# EAGLE design BusinessCard (EAGLE 7.4.0)
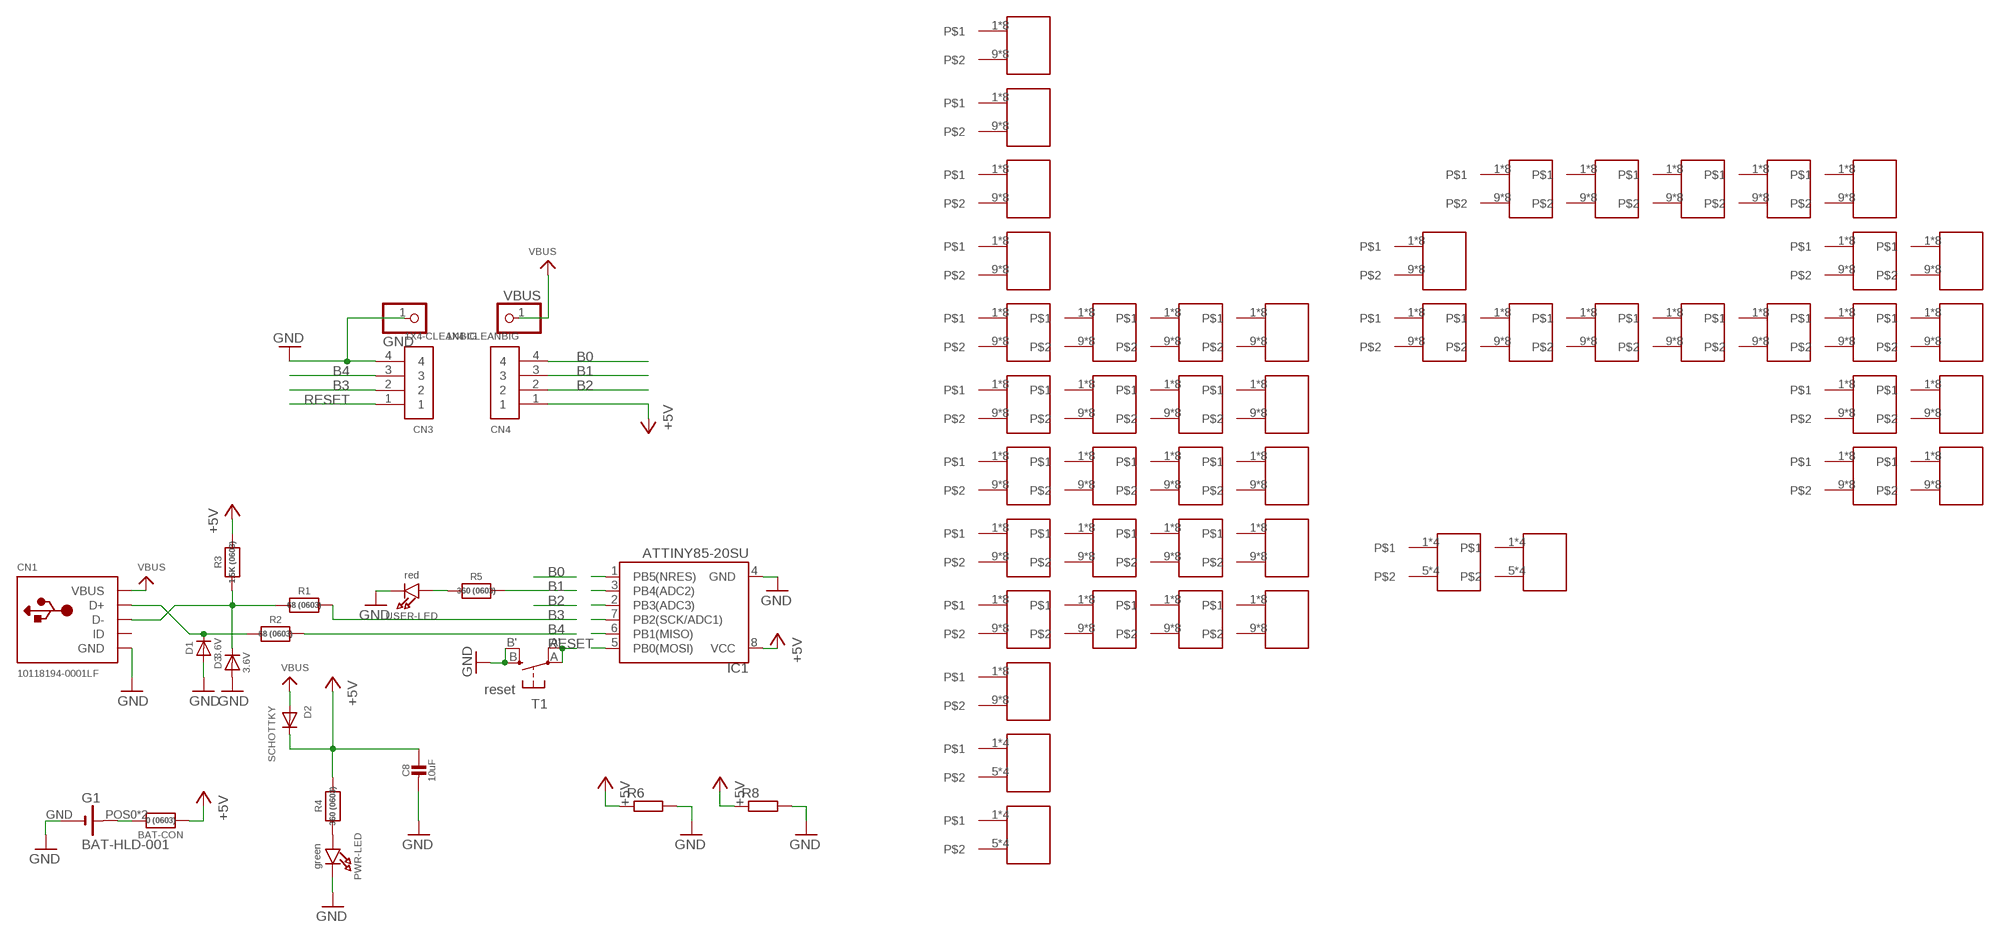
[diagram p0: schematic, sheet 1]

## Parts
BAT-CON  0 (0603)  RESISTOR_0603_NOOUT  [0603-NO]
C8  10uF  CAP_CERAMIC0805-NOOUTLINE  [0805-NO]
CN1  10118194-0001LF  USBMICRO_20329  [4UCONN_20329]
CN3  1X4-CLEANBIG  [1X04-CLEANBIG]
CN4  1X4-CLEANBIG  [1X04-CLEANBIG]
D1  3.6V  DIODESOD-323  [SOD-323]
D2  SCHOTTKY  DIODE_SOD-123FL  [SOD-123FL]
D3  3.6V  DIODESOD-323  [SOD-323]
G1  BAT-HLD-001  BK-889  [BK-889]
GND  PINHD-1X1CB  [1X01-CLEANBIG]
IC1  ATTINY85-20SU  ATTINY45TINY85-20-SMT  [SO08-EIAJ]
PWR-LED  green  LED0805_NOOUTLINE  [CHIPLED_0805_NOOUTLINE]
R1  68 (0603)  RESISTOR_0603_NOOUT  [0603-NO]
R2  68 (0603)  RESISTOR_0603_NOOUT  [0603-NO]
R3  1.5K (0603)  RESISTOR_0603_NOOUT  [0603-NO]
R4  360 (0603)  RESISTOR_0603_NOOUT  [0603-NO]
R5  360 (0603)  RESISTOR_0603_NOOUT  [0603-NO]
R6  R-EU_M0805  [M0805]
R8  R-EU_M0805  [M0805]
T1  reset  EVQQ2  [EVQ-Q2]
U$5  SMD0805  [SMD-0603]
U$6  SMD0805  [SMD-0603]
U$7  SMD0805  [SMD-0603]
U$8  SMD0805  [SMD-0603]
U$9  SMD0805  [SMD-0603]
U$13  SMD0805  [SMD-0603]
U$15  SMD0805  [SMD-0603]
U$17  SMD0805  [SMD-0603]
U$18  SMD0805  [SMD-0603]
U$19  SMD0805  [SMD-0603]
U$20  SMD0805  [SMD-0603]
U$21  SMD0805  [SMD-0603]
U$22  SMD0805  [SMD-0603]
U$23  SMD0805  [SMD-0603]
U$24  SMD0805  [SMD-0603]
U$25  SMD0805  [SMD-0603]
U$26  SMD0805  [SMD-0603]
U$27  SMD0805  [SMD-0603]
U$28  SMD0805  [SMD-0603]
U$29  SMD0805  [SMD-0603]
U$30  SMD0805  [SMD-0603]
U$31  SMD0805  [SMD-0603]
U$32  SMD0805  [SMD-0603]
U$33  SMD0805  [SMD-0603]
U$34  SMD0805  [SMD-0603]
U$35  SMD0805  [SMD-0603]
U$36  SMD0805  [SMD-0603]
U$37  SMD0805  [SMD-0603]
U$38  SMD-4  [SMD-4]
U$39  SMD-4  [SMD-4]
U$40  SMD0805  [SMD-0603]
U$43  SMD0805  [SMD-0603]
U$45  SMD0805  [SMD-0603]
U$48  SMD0805  [SMD-0603]
U$50  SMD0805  [SMD-0603]
U$53  SMD0805  [SMD-0603]
U$55  SMD0805  [SMD-0603]
U$56  SMD0805  [SMD-0603]
U$57  SMD0805  [SMD-0603]
U$58  SMD0805  [SMD-0603]
U$59  SMD0805  [SMD-0603]
U$60  SMD0805  [SMD-0603]
U$61  SMD0805  [SMD-0603]
U$62  SMD0805  [SMD-0603]
U$63  SMD0805  [SMD-0603]
U$64  SMD0805  [SMD-0603]
U$65  SMD-4  [SMD-4]
U$66  SMD-4  [SMD-4]
USER-LED  red  LED0805_NOOUTLINE  [CHIPLED_0805_NOOUTLINE]
VBUS  PINHD-1X1CB  [1X01-CLEANBIG]

## Nets
+5V: BAT-CON.1 C8.1 CN4.1 D2.C IC1.8(VCC) R3.2 R4.2 R6.1 R8.1
B0: CN4.4 IC1.5(PB0(MOSI))
B1: CN4.3 IC1.6(PB1(MISO)) R5.2
B2: CN4.2 IC1.7(PB2(SCK/ADC1))
B3: CN3.2 IC1.2(PB3(ADC3)) R1.2
B4: CN3.3 IC1.3(PB4(ADC2)) R2.2
GND: C8.2 CN1.BASE@1(GND) CN1.BASE@2(GND) CN1.GND CN1.SPRT@1(GND) CN1.SPRT@2(GND) CN1.SPRT@3(GND) CN1.SPRT@4(GND) CN3.4 D1.A D3.A G1.GND(-) GND.1 IC1.4(GND) PWR-LED.C R6.2 R8.2 T1.B'(S1) T1.B(S) USER-LED.C
N$1: R5.1 USER-LED.A
N$2: CN1.D+ D1.C R2.1
N$3: BAT-CON.2 G1.POS0(+) G1.POS1(+)
N$5: CN1.D- D3.C R1.1 R3.1
N$6: PWR-LED.A R4.1
RESET: CN3.1 IC1.1(PB5(NRES)) T1.A'(P1) T1.A(P)
VBUS: CN1.VBUS D2.A VBUS.1
Unconnected: CN1.ID U$5.1 U$5.2 U$5.3 U$5.4 U$5.5 U$5.6 U$5.7 U$5.8 U$5.9 U$5.10 U$5.11 U$5.12 U$5.13 U$5.14 U$5.15 U$5.16 U$6.1 U$6.2 U$6.3 U$6.4 U$6.5 U$6.6 U$6.7 U$6.8 U$6.9 U$6.10 U$6.11 U$6.12 U$6.13 U$6.14 U$6.15 U$6.16 U$7.1 U$7.2 U$7.3 U$7.4 U$7.5 U$7.6 U$7.7 U$7.8 U$7.9 U$7.10 U$7.11 U$7.12 U$7.13 U$7.14 U$7.15 U$7.16 U$8.1 U$8.2 U$8.3 U$8.4 U$8.5 U$8.6 U$8.7 U$8.8 U$8.9 U$8.10 U$8.11 U$8.12 U$8.13 U$8.14 U$8.15 U$8.16 U$9.1 U$9.2 U$9.3 U$9.4 U$9.5 U$9.6 U$9.7 U$9.8 U$9.9 U$9.10 U$9.11 U$9.12 U$9.13 U$9.14 U$9.15 U$9.16 U$13.1 U$13.2 U$13.3 U$13.4 U$13.5 U$13.6 U$13.7 U$13.8 U$13.9 U$13.10 U$13.11 U$13.12 U$13.13 U$13.14 U$13.15 U$13.16 U$15.1 U$15.2 U$15.3 U$15.4 U$15.5 U$15.6 U$15.7 U$15.8 U$15.9 U$15.10 U$15.11 U$15.12 U$15.13 U$15.14 U$15.15 U$15.16 U$17.1 U$17.2 U$17.3 U$17.4 U$17.5 U$17.6 U$17.7 U$17.8 U$17.9 U$17.10 U$17.11 U$17.12 U$17.13 U$17.14 U$17.15 U$17.16 U$18.1 U$18.2 U$18.3 U$18.4 U$18.5 U$18.6 U$18.7 U$18.8 U$18.9 U$18.10 U$18.11 U$18.12 U$18.13 U$18.14 U$18.15 U$18.16 U$19.1 U$19.2 U$19.3 U$19.4 U$19.5 U$19.6 U$19.7 U$19.8 U$19.9 U$19.10 U$19.11 U$19.12 U$19.13 U$19.14 U$19.15 U$19.16 U$20.1 U$20.2 U$20.3 U$20.4 U$20.5 U$20.6 U$20.7 U$20.8 U$20.9 U$20.10 U$20.11 U$20.12 U$20.13 U$20.14 U$20.15 U$20.16 U$21.1 U$21.2 U$21.3 U$21.4 U$21.5 U$21.6 U$21.7 U$21.8 U$21.9 U$21.10 U$21.11 U$21.12 U$21.13 U$21.14 U$21.15 U$21.16 U$22.1 U$22.2 U$22.3 U$22.4 U$22.5 U$22.6 U$22.7 U$22.8 U$22.9 U$22.10 U$22.11 U$22.12 U$22.13 U$22.14 U$22.15 U$22.16 U$23.1 U$23.2 U$23.3 U$23.4 U$23.5 U$23.6 U$23.7 U$23.8 U$23.9 U$23.10 U$23.11 U$23.12 U$23.13 U$23.14 U$23.15 U$23.16 U$24.1 U$24.2 U$24.3 U$24.4 U$24.5 U$24.6 U$24.7 U$24.8 U$24.9 U$24.10 U$24.11 U$24.12 U$24.13 U$24.14 U$24.15 U$24.16 U$25.1 U$25.2 U$25.3 U$25.4 U$25.5 U$25.6 U$25.7 U$25.8 U$25.9 U$25.10 U$25.11 U$25.12 U$25.13 U$25.14 U$25.15 U$25.16 U$26.1 U$26.2 U$26.3 U$26.4 U$26.5 U$26.6 U$26.7 U$26.8 U$26.9 U$26.10 U$26.11 U$26.12 U$26.13 U$26.14 U$26.15 U$26.16 U$27.1 U$27.2 U$27.3 U$27.4 U$27.5 U$27.6 U$27.7 U$27.8 U$27.9 U$27.10 U$27.11 U$27.12 U$27.13 U$27.14 U$27.15 U$27.16 U$28.1 U$28.2 U$28.3 U$28.4 U$28.5 U$28.6 U$28.7 U$28.8 U$28.9 U$28.10 U$28.11 U$28.12 U$28.13 U$28.14 U$28.15 U$28.16 U$29.1 U$29.2 U$29.3 U$29.4 U$29.5 U$29.6 U$29.7 U$29.8 U$29.9 U$29.10 U$29.11 U$29.12 U$29.13 U$29.14 U$29.15 U$29.16 U$30.1 U$30.2 U$30.3 U$30.4 U$30.5 U$30.6 U$30.7 U$30.8 U$30.9 U$30.10 U$30.11 U$30.12 U$30.13 U$30.14 U$30.15 U$30.16 U$31.1 U$31.2 U$31.3 U$31.4 U$31.5 U$31.6 U$31.7 U$31.8 U$31.9 U$31.10 U$31.11 U$31.12 U$31.13 U$31.14 U$31.15 U$31.16 U$32.1 U$32.2 U$32.3 U$32.4 U$32.5 U$32.6 U$32.7 U$32.8 U$32.9 U$32.10 U$32.11 U$32.12 U$32.13 U$32.14 U$32.15 U$32.16 U$33.1 U$33.2 U$33.3 U$33.4 U$33.5 U$33.6 U$33.7 U$33.8 U$33.9 U$33.10 U$33.11 U$33.12 U$33.13 U$33.14 U$33.15 U$33.16 U$34.1 U$34.2 U$34.3 U$34.4 U$34.5 U$34.6 U$34.7 U$34.8 U$34.9 U$34.10 U$34.11 U$34.12 U$34.13 U$34.14 U$34.15 U$34.16 U$35.1 U$35.2 U$35.3 U$35.4 U$35.5 U$35.6 U$35.7 U$35.8 U$35.9 U$35.10 U$35.11 U$35.12 U$35.13 U$35.14 U$35.15 U$35.16 U$36.1 U$36.2 U$36.3 U$36.4 U$36.5 U$36.6 U$36.7 U$36.8 U$36.9 U$36.10 U$36.11 U$36.12 U$36.13 U$36.14 U$36.15 U$36.16 U$37.1 U$37.2 U$37.3 U$37.4 U$37.5 U$37.6 U$37.7 U$37.8 U$37.9 U$37.10 U$37.11 U$37.12 U$37.13 U$37.14 U$37.15 U$37.16 U$38.1 U$38.2 U$38.3 U$38.4 U$38.5 U$38.6 U$38.7 U$38.8 U$39.1 U$39.2 U$39.3 U$39.4 U$39.5 U$39.6 U$39.7 U$39.8 U$40.1 U$40.2 U$40.3 U$40.4 U$40.5 U$40.6 U$40.7 U$40.8 U$40.9 U$40.10 U$40.11 U$40.12 U$40.13 U$40.14 U$40.15 U$40.16 U$43.1 U$43.2 U$43.3 U$43.4 U$43.5 U$43.6 U$43.7 U$43.8 U$43.9 U$43.10 U$43.11 U$43.12 U$43.13 U$43.14 U$43.15 U$43.16 U$45.1 U$45.2 U$45.3 U$45.4 U$45.5 U$45.6 U$45.7 U$45.8 U$45.9 U$45.10 U$45.11 U$45.12 U$45.13 U$45.14 U$45.15 U$45.16 U$48.1 U$48.2 U$48.3 U$48.4 U$48.5 U$48.6 U$48.7 U$48.8 U$48.9 U$48.10 U$48.11 U$48.12 U$48.13 U$48.14 U$48.15 U$48.16 U$50.1 U$50.2 U$50.3 U$50.4 U$50.5 U$50.6 U$50.7 U$50.8 U$50.9 U$50.10 U$50.11 U$50.12 U$50.13 U$50.14 U$50.15 U$50.16 U$53.1 U$53.2 U$53.3 U$53.4 U$53.5 U$53.6 U$53.7 U$53.8 U$53.9 U$53.10 U$53.11 U$53.12 U$53.13 U$53.14 U$53.15 U$53.16 U$55.1 U$55.2 U$55.3 U$55.4 U$55.5 U$55.6 U$55.7 U$55.8 U$55.9 U$55.10 U$55.11 U$55.12 U$55.13 U$55.14 U$55.15 U$55.16 U$56.1 U$56.2 U$56.3 U$56.4 U$56.5 U$56.6 U$56.7 U$56.8 U$56.9 U$56.10 U$56.11 U$56.12 U$56.13 U$56.14 U$56.15 U$56.16 U$57.1 U$57.2 U$57.3 U$57.4 U$57.5 U$57.6 U$57.7 U$57.8 U$57.9 U$57.10 U$57.11 U$57.12 U$57.13 U$57.14 U$57.15 U$57.16 U$58.1 U$58.2 U$58.3 U$58.4 U$58.5 U$58.6 U$58.7 U$58.8 U$58.9 U$58.10 U$58.11 U$58.12 U$58.13 U$58.14 U$58.15 U$58.16 U$59.1 U$59.2 U$59.3 U$59.4 U$59.5 U$59.6 U$59.7 U$59.8 U$59.9 U$59.10 U$59.11 U$59.12 U$59.13 U$59.14 U$59.15 U$59.16 U$60.1 U$60.2 U$60.3 U$60.4 U$60.5 U$60.6 U$60.7 U$60.8 U$60.9 U$60.10 U$60.11 U$60.12 U$60.13 U$60.14 U$60.15 U$60.16 U$61.1 U$61.2 U$61.3 U$61.4 U$61.5 U$61.6 U$61.7 U$61.8 U$61.9 U$61.10 U$61.11 U$61.12 U$61.13 U$61.14 U$61.15 U$61.16 U$62.1 U$62.2 U$62.3 U$62.4 U$62.5 U$62.6 U$62.7 U$62.8 U$62.9 U$62.10 U$62.11 U$62.12 U$62.13 U$62.14 U$62.15 U$62.16 U$63.1 U$63.2 U$63.3 U$63.4 U$63.5 U$63.6 U$63.7 U$63.8 U$63.9 U$63.10 U$63.11 U$63.12 U$63.13 U$63.14 U$63.15 U$63.16 U$64.1 U$64.2 U$64.3 U$64.4 U$64.5 U$64.6 U$64.7 U$64.8 U$64.9 U$64.10 U$64.11 U$64.12 U$64.13 U$64.14 U$64.15 U$64.16 U$65.1 U$65.2 U$65.3 U$65.4 U$65.5 U$65.6 U$65.7 U$65.8 U$66.1 U$66.2 U$66.3 U$66.4 U$66.5 U$66.6 U$66.7 U$66.8

## Library data of the parts
BAT-CON R1-R5 = microbuilder:RESISTOR: Resistors For new designs, use the packages preceded by an '_' character since they are more reliable: The following footprints should be used on most boards: _0402 - Standard footprint for regular board layouts _0603 - Standard footprint for regular board layouts _0805 - Standard footprint for regular board layouts _1206 - Standard footprint for regular board layouts For extremely tight-pitch boards where space is at a premium, the following 'micro-pitch' footprints can be used (smaller pads, no silkscreen outline, etc.): _0402MP - Micro-pitch footprint for very dense/compact boards _0603MP - Micro-pitch footprint for very dense/compact boards _0805MP - Micro-pitch footprint for very dense/compact boards _1206MP - Micro-pitch footprint for very dense/compact boards
C8 = microbuilder:CAP_CERAMIC: Ceramic Capacitors For new designs, use the packages preceded by an '_' character since they are more reliable: The following footprints should be used on most boards: _0402 - Standard footprint for regular board layouts _0603 - Standard footprint for regular board layouts _0805 - Standard footprint for regular board layouts _1206 - Standard footprint for regular board layouts For extremely tight-pitch boards where space is at a premium, the following 'micro-pitch' footprints can be used (smaller pads, no silkscreen outline, etc.): _0402MP - Micro-pitch footprint for very dense/compact boards _0603MP - Micro-pitch footprint for very dense/compact boards _0805MP - Micro-pitch footprint for very dense/compact boards _1206MP - Micro-pitch footprint for very dense/compact boards
CN1 = microbuilder:USB: USB Connectors USBMINIB - Surface Mount Female Mini-B USB Connector 4UConnector: 06564
CN3 CN4 = adafruit:1X4: 4-pin connector
D1 D3 = microbuilder:DIODE: Diode
D2 = adafruit:DIODE: Diode
G1 = battery:BK-889: CION CELL RETAINER FOR 23mm DIA. BATTERIES BR2320, CL2320, CR2320, BR2325, CR2325, DL2325, BR2330, CL2330 Source: MEMORY PROTECTION DEVICES; Inc. BK-889-datasheet.pdf
GND VBUS = adafruit:PINHD-1X1: Pin header 1x1 for 0.1" spacing With round pins
IC1 = SparkFun-DigitalIC:ATTINY45: Atmel 8-pin 2/4/8kB flash uC; PROD_ID: IC-09092; VALUE: Tiny85-20-SMT
PWR-LED USER-LED = microbuilder:LED: LED 0603 - 0603 Surface Mount Package 2mA: Green LED - Low Power (3.9mcd, 2ma, 1.7Vf) - Digikey: 475-2709-2-ND Orange LED - Low Power (9.8mcd, 2ma, 1.8Vf) - Digikey: 475-1194-2-ND Red LED - Low Power (5mcd, 2ma, 1.8Vf) - Digikey: 475-1195-2-ND Yellow LED - Low Power (7mcd, 2ma, 1.8Vf) - Digikey: 475-1196-2-ND 5mA: Blue LED - Low Power (17mcd, 5ma, 2.9Vf) - Digikey: LNJ937W8CRACT-ND 0805 - 0805 Surface Mount Package 2mA: Red LED (8.8mcd, 2mA, 1.8Vf, Clear) - Low Power [Digikey: 475-2510-1-ND] Green LED (5mcd, 2mA, 1.8Vf, Clear) - Low Power [Digikey: 475-2730-1-ND] Yellow LED (11.3mcd, 2mA, 1.8Vf, Clear) - Low Power [Digikey: 475-2555-1-ND] 20mA: Red LED (104mcd, 20mA, Diffused) - LS R976 [Digikey: 475-1278-6-ND] Red LED (12mcd, 20mA, 2.0Vf, Clear) - APT2012EC [Digikey: 754-1128-1-ND] Green LED (15mcd, 20mA, 2.2Vf, Clear) - APT2012GC [Digikey: 754-1131-1-ND] Orange LED (160mcd, 20mA, 2.1Vf, Clear) - APT2012SECK [Digikey: 754-1130-1-ND] 1206 - 1206 Surface Mount Package Green LED (26mcd, 20mA, Diffused) - LG N971 [Digikey: 475-1407-6-ND] Red LED (15mcd, 20mA, Diffused) - LH N974 [Digikey: 475-1416-6-ND] Cree - Cree High-Power Surface Mount LEDs XPEBWT-L1-0000-00D50 - White 111lm 350mA 2.9Vf 6200K 110° XTEAWT-00-0000-00000LEE3 - White 114lm 350mA 2.85Vf 5000K 115° Everlight - Everlight 45-21 Series Surface Mount LEDs 45-21/QK2C-B2832AC2CB2/2T - Warm White 2000mcd 20mA 3.25Vf 3050K 120° 45-21/LK2C-B38452C4CB2/2T - Nuetral White 2000mcd 20mA 3.25Vf 4150K 120° 45-21/LK2C-B50634C6CB2/2T - Cold White 2200mcd 20mA 3.25Vf 5650K 120° PLCC2 Reverse Mount LS T77K-J1L2-1-0-2-R18-Z - Red 11.25mcd 2mA 1.8Vf 630nm 120° LO T77K-L1M2-24-Z - Orange 19.6mcd 2mA 1.8Vf 606nm 120° LY T77K-K2M1-26-Z - Yellow 15.7mcd 2mA 1.8Vf 587nm 120°
R6 R8 = rcl:R-EU_: RESISTOR, European symbol
T1 = adafruit:EVQQ2: SMT 6mm switch, EVQQ2 series http://www.ladyada.net/library/eagle
U$5-U$9 U$13 U$15 U$17-U$37 U$40 U$43 U$45 U$48 U$50 U$53 U$55-U$64 = zwave:SMD0805
U$38 U$39 U$65 U$66 = zwave:SMD-4

## Board
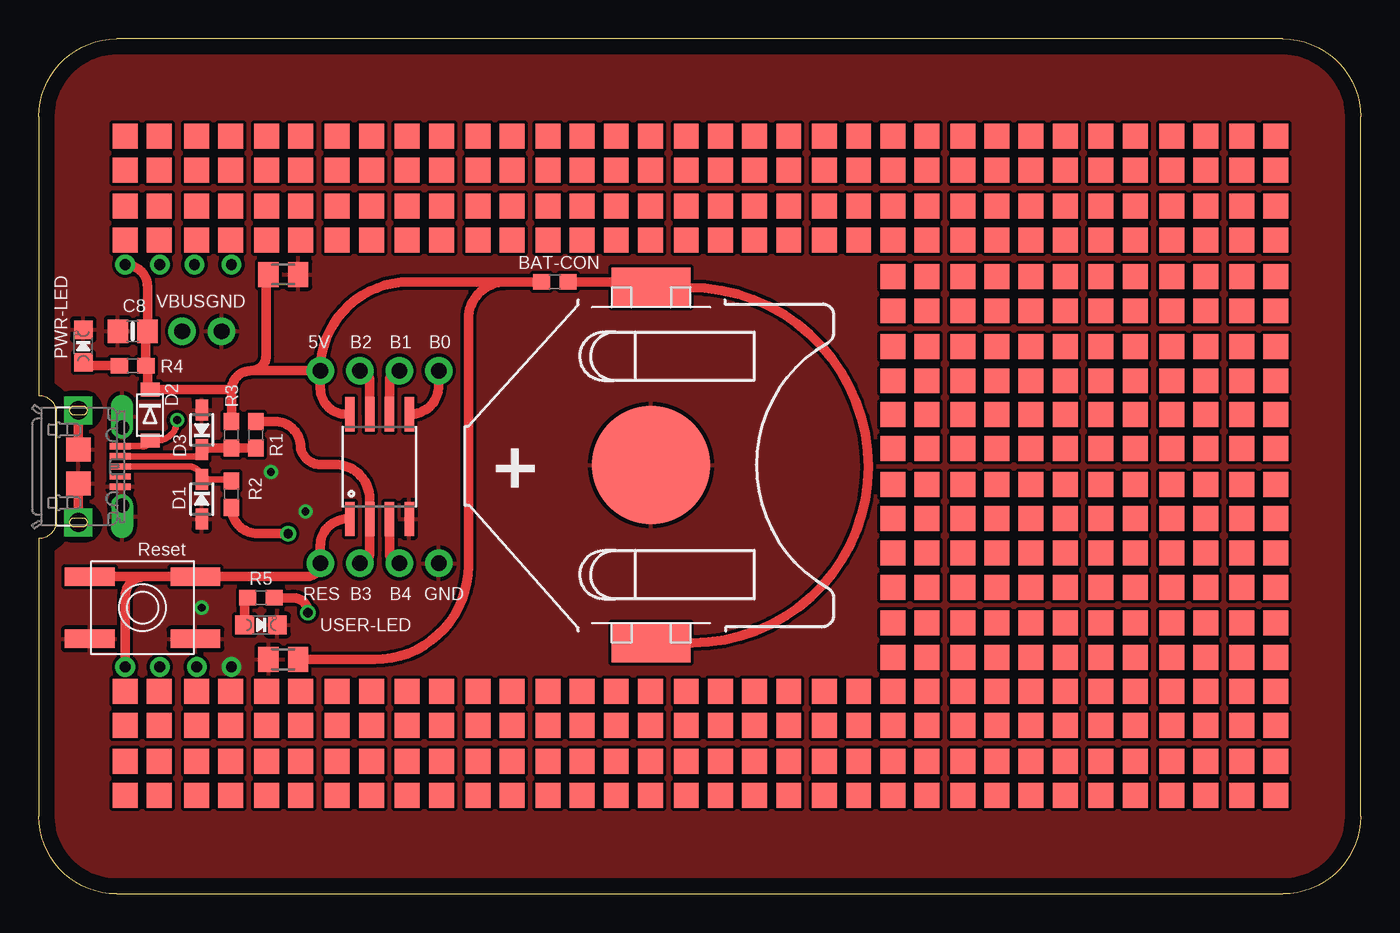
[diagram p1: board, top side]
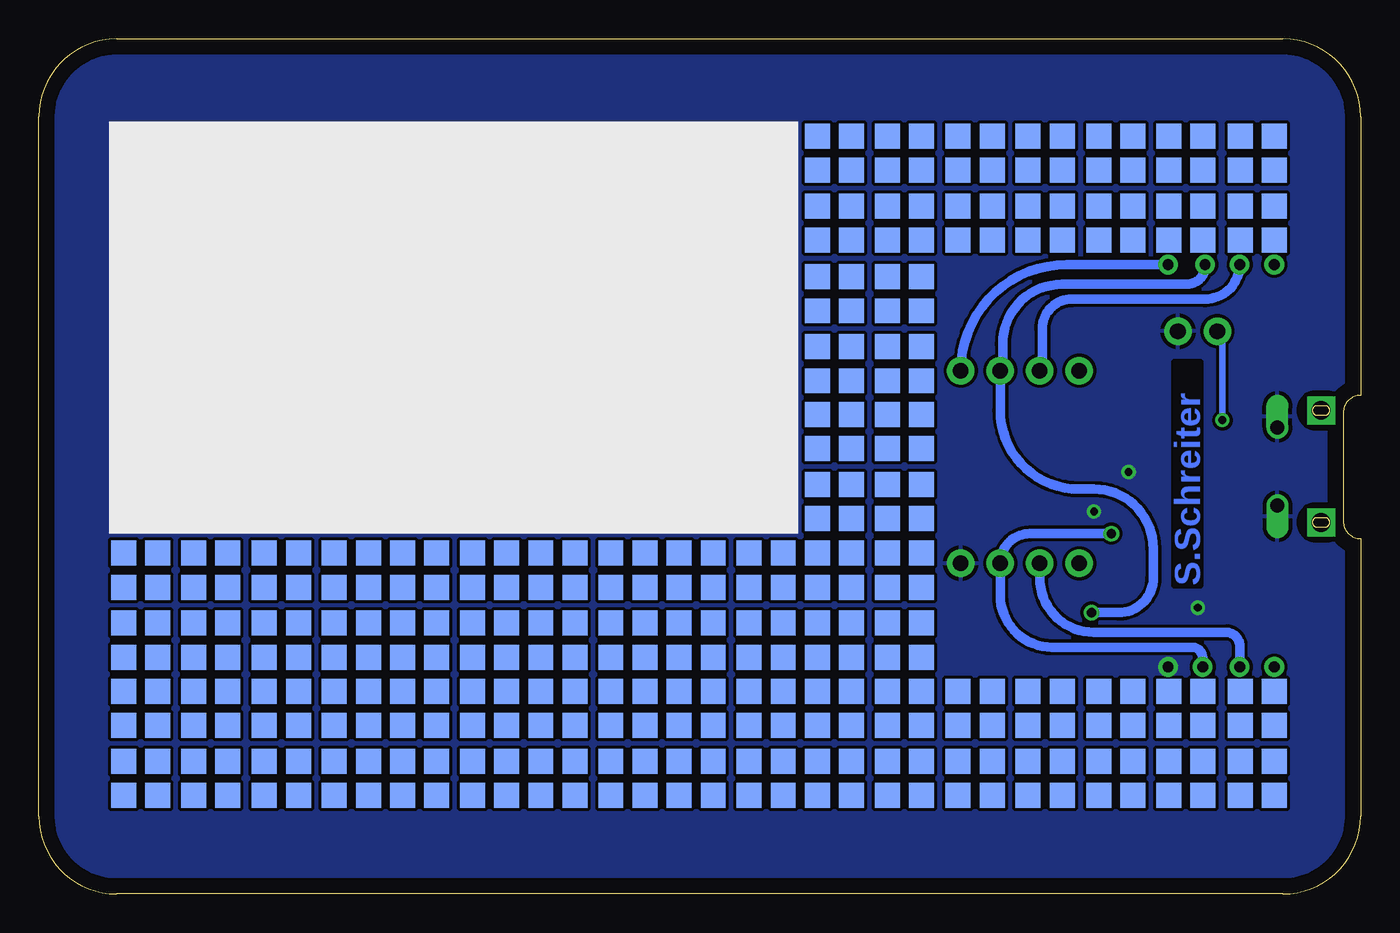
[diagram p2: board, bottom side, seen from below]

Size 85 x 55 mm. Coordinates in mm from the lower left corner, seen from the top.
Outline: 5,0 80,0 arc90 85,5 85,50 arc90 80,55 5,55 arc90 0,50 0,32.07 arc-90 1.11,30.96 1.11,23.97 arc-90 0,22.86 0,5 arc90 5,0
Copper layers (1*16): Top 0.035mm / dielectric 1.5mm / Bottom 0.035mm
Design rules "default": minimum track width 10mil, minimum drill 24mil, track to track 8mil, track to pad 8mil, pad to pad 8mil, via to via 8mil, smd to smd 8mil, copper to edge 40mil, drill to drill 8mil, minimum pad ring 10mil, minimum via ring 8mil, stop-mask expansion 4mil, vias tented up to drill 0mil, thermal gap 10mil

### Footprints (pad centres in the part's own frame; a part is rotated, then mirrored left to right if it is on the bottom)
0603-NO = smd 1.1 x 1: 1 -0.85,0; 2 0.85,0
0805-NO = smd 1.3 x 1.5: 1 -0.95,0; 2 0.95,0
4UCONN_20329 = smd 1.55 x 1.55: BASE@1 -1.1,-1.9; BASE@2 1.1,-1.9 | smd 0.4 x 1.35: D+ 0,0.775; D- -0.65,0.775; GND 1.3,0.775; ID 0.65,0.775; VBUS -1.3,0.775 | drill 0.9 offset: SPRT@1 -2.5,0.9; SPRT@2 2.5,0.9 | drill 1.2 pad 1.65 square: SPRT@3 -3.6,-1.9; SPRT@4 3.6,-1.9
1X04-CLEANBIG = drill 1.016 pad 1.778: 1 -3.81,0; 2 -1.27,0; 3 1.27,0; 4 3.81,0
SOD-323 = smd 1.35 x 0.8: A 1.27,0; C -1.27,0
SOD-123FL = smd 0.91 x 1.22: A 1.637,0; C -1.637,0
BK-889 = smd 7.62 x 7.62: GND 0,0 | smd 2.54 x 5.08: POS0 -11.43,0; POS1 11.43,0
1X01-CLEANBIG = drill 1.016 pad 1.778: 1 0,0
SO08-EIAJ = smd 0.61 x 2.21: 1 -1.905,-3.378; 2 -0.635,-3.378; 3 0.635,-3.378; 4 1.905,-3.378; 5 1.905,3.353; 6 0.635,3.353; 7 -0.635,3.353; 8 -1.905,3.353
CHIPLED_0805_NOOUTLINE = smd 1.2 x 1.2: A 0,-1.05; C 0,1.05
M0805 = smd 1.3 x 1.6: 1 -0.95,0; 2 0.95,0
EVQ-Q2 = smd 3.2 x 1.2: A -3.4,-2; A' 3.4,-2; B -3.4,2; B' 3.4,2
SMD-0603 = smd 1.6 x 1.6: 1 -1.15,3.35; 2 -3.35,1.15; 3 -1.15,1.15; 4 -3.35,3.35; 5 1.15,3.35; 6 3.35,3.35; 7 1.15,1.15; 8 3.35,1.15; 9 -3.35,-1.15; 10 -1.15,-1.15; 11 -3.35,-3.35; 12 -1.15,-3.35; 13 1.15,-1.15; 14 3.35,-1.15; 15 1.15,-3.35; 16 3.35,-3.35
SMD-4 = smd 1.6 x 1.6: 1 -1.15,1.127; 2 -3.35,-1.073; 3 -1.15,-1.073; 4 -3.35,1.127; 5 1.15,1.127; 6 3.35,1.127; 7 1.15,-1.073; 8 3.35,-1.073

### Placement (x,y rotation side)
BAT-CON  33.18,39.37 0 top
C8  6.03,36.2 180 top
CN1  4.45,27.5 270 top
CN3  21.91,21.27 0 top
CN4  21.91,33.66 0 top
D1  10.48,25.4 270 top
D2  7.14,30.8 270 top
D3  10.48,29.84 90 top
G1  39.37,27.59 270 top
GND  11.75,36.2 0 top
IC1  21.91,27.5 0 top
PWR-LED  2.86,35.24 0 top
R1  13.97,29.53 90 top
R2  12.38,25.72 270 top
R3  12.38,29.53 90 top
R4  6.03,33.97 0 top
R5  14.29,19.05 0 top
R6  15.72,39.85 0 top
R8  15.72,15.08 180 top
T1  6.67,18.41 180 top
U$5  31.59,45.4 0 top
U$6  76.2,18.57 0 bottom
U$7  31.59,9.68 0 top
U$8  40.48,45.4 0 top
U$9  76.2,9.68 0 bottom
U$13  40.48,9.68 0 top
U$15  67.15,18.57 0 bottom
U$17  58.26,36.35 0 top
U$18  49.37,9.68 0 top
U$19  49.37,45.4 0 top
U$20  58.26,45.4 0 top
U$21  58.26,18.57 0 top
U$22  58.26,27.5 0 top
U$23  58.26,9.68 0 top
U$24  67.15,27.5 0 top
U$25  67.15,36.35 0 top
U$26  67.15,45.4 0 top
U$27  76.2,27.5 0 top
U$28  76.2,36.35 0 top
U$29  67.15,18.57 0 top
U$30  76.2,45.4 0 top
U$31  76.2,18.57 0 top
U$32  67.15,9.68 0 top
U$33  76.2,9.68 0 top
U$34  22.54,9.68 0 top
U$35  13.49,9.68 0 top
U$36  22.54,45.4 0 top
U$37  13.49,45.4 0 top
U$38  6.67,45.4 90 top
U$39  6.67,9.68 90 top
U$40  67.15,9.68 0 bottom
U$43  58.26,18.57 0 bottom
U$45  58.26,9.68 0 bottom
U$48  49.37,18.57 0 bottom
U$50  49.37,9.68 0 bottom
U$53  40.48,18.57 0 bottom
U$55  40.48,9.68 0 bottom
U$56  31.59,9.68 0 bottom
U$57  31.59,27.5 0 bottom
U$58  22.54,9.68 0 bottom
U$59  31.59,45.4 0 bottom
U$60  22.54,45.4 0 bottom
U$61  13.49,45.4 0 bottom
U$62  13.49,9.68 0 bottom
U$63  31.59,36.35 0 bottom
U$64  31.59,18.57 0 bottom
U$65  6.67,45.4 270 bottom
U$66  6.67,9.68 270 bottom
USER-LED  14.29,17.3 270 top
VBUS  9.21,36.2 0 top

### Tracks (layer width: path | path; a pad name or v marks a point on that pad's centre or on a via)
+5V  (via drill 0.7 pad 1.27)
  Top 0.61: R3.2 12.38,32.38 | 12.38,32.38 arc-90 13.65,33.66 | 13.65,33.66 CN4.1 | 12.38,32.38 arc90 12.33,32.44 D2.C arc-90 6.99,32.59 6.99,33.87 arc90 R4.2 6.88,36.09 arc-90 C8.1 6.98,39.05 arc90 v5.56,40.48 | BAT-CON.1 30,39.37 | 30,39.37 23.81,39.37 arc90 CN4.1 | CN4.1 18.1,32.54 arc90 19.79,30.85 IC1.8 | 13.65,33.66 arc90 14.61,34.61 14.61,39.69 arc-90 R6.1 | R8.1 21.59,15.08 arc90 27.62,21.11 27.62,36.99 arc-90 30,39.37
B0  (via drill 0.7 pad 1.27)
  Top 0.61: IC1.5 23.87,30.85 arc90 25.72,32.7 CN4.4
  Bottom 0.61: v12.38,40.48 18.89,40.48 arc-90 CN4.4
B1  (via drill 0.6, 0.7 pad 1.27)
  Top 0.61: IC1.6 22.54,33.02 arc-90 CN4.3 | R5.2 16.35,19.05 arc-90 v17.3,18.1
  Bottom 0.61: v10,40.48 arc90 11.11,39.21 19.21,39.21 arc-90 23.02,35.4 23.02,33.81 arc90 CN4.3 23.18,31.11 arc-90 18.1,26.04 17.14,26.04 arc90 13.34,22.23 13.34,20.32 arc90 15.56,18.1 v17.3,18.1
B2  (via drill 0.7 pad 1.27)
  Top 0.61: IC1.7 21.27,33.02 arc90 CN4.2
  Bottom 0.61: v7.78,40.48 arc90 10,38.26 18.57,38.26 arc-90 20.48,36.35 20.48,33.81 arc90 CN4.2
B3  (via drill 0.7 pad 1.27)
  Top 0.61: R1.2 15.03,30.38 arc-90 16.83,28.89 arc90 18.1,27.62 19.05,27.62 arc-90 21.27,25.4 IC1.2 21.27,21.91 arc-90 CN3.2
  Bottom 0.61: v7.78,14.61 7.78,15.88 arc-90 8.57,16.83 17.14,16.83 arc90 20.64,20.32 CN3.2
B4  (via drill 0.6, 0.7 pad 1.27)
  Top 0.61: R2.2 arc90 14.07,23.18 v16.03,23.18 | IC1.3 22.54,21.91 arc90 CN3.3
  Bottom 0.61: v16.03,23.18 21.27,23.18 arc-90 CN3.3 23.18,19.21 arc-90 19.84,15.88 10.79,15.88 arc90 10.16,15.08 v10.16,14.61
GND  (via drill 0.5, 0.7 pad 1.27)
  Top 0.61: CN1.BASE@1 CN1.SPRT@3 | CN1.BASE@2 CN1.SPRT@4
  other vias: 17.14,24.61 14.92,27.15 12.38,14.61 10.48,18.41
  pour Top: 0,0 85.09,0 85.09,54.61 85.09,55.88 0,55.88
  pour Bottom: 0,0 85.09,0 85.09,55.88 0,55.88
N$1
  Top 0.61: USER-LED.A 13.24,18.85 arc-90 R5.1
N$2
  Top 0.406: CN1.D+ 9.65,27.5 arc-90 D1.C 12.28,26.67 arc-90 R2.1
N$3
  Top 0.61: BAT-CON.2 39.02,39.37 arc-90 G1.POS0 41.79,39.02 arc-90 53.34,27.46 arc-90 42.03,16.16 G1.POS1
N$5
  Top 0.406: CN1.D- 10.05,28.15 arc90 D3.C
  Top 0.61: R1.1 R3.1 10.58,28.68 arc90 D3.C
N$6
  Top 0.61: R4.1 3.08,33.97 arc-90 PWR-LED.A
RESET  (via drill 0.7 pad 1.27)
  Top 0.61: T1.A' 6.83,20.41 | 6.83,20.41 T1.A 17.24,20.41 arc90 CN3.1 18.1,22.38 arc-90 19.84,24.12 IC1.1 | v5.56,14.61 5.56,19.14 arc-90 6.83,20.41
VBUS  (via drill 0.5)
  Top 0.406: CN1.VBUS 6.62,28.8 arc90 D2.A 7.57,29.16 arc90 v8.89,30.48
  Bottom 0.406: v8.89,30.48 8.89,35.88 arc-90 VBUS.1

### Text on the board
Bottom: S.Schreiter
tNames: 5V | B2 | B1 | B0 | Reset | RES | B3 | B4 | GND